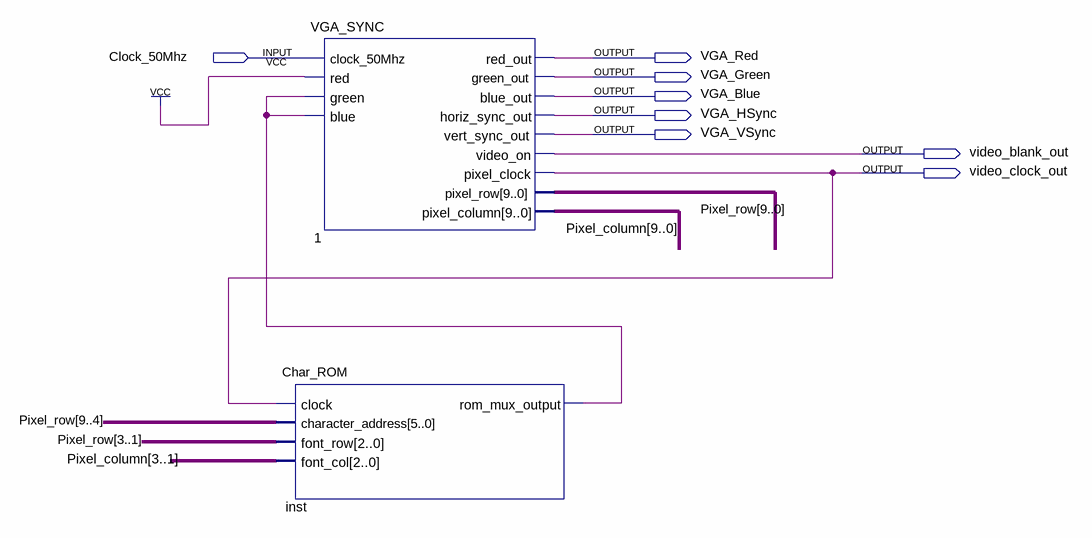
[diagram p0: schematic sheet]
// Quartus schematic VGA_CHARACTER.bdf as structural Verilog: 2 symbols, 8 pins
module VGA_CHARACTER (
  input  Clock_50Mhz,
  output VGA_Red,
  output VGA_Green,
  output VGA_Blue,
  output VGA_HSync,
  output VGA_VSync,
  output video_blank_out,
  output video_clock_out
);

  wire inst_rom_mux_output;
  wire [9:0] Pixel_column, Pixel_row;

  VGA_SYNC u_1 (
    .red(1'b1), .green(inst_rom_mux_output), .blue(inst_rom_mux_output), .clock_50Mhz(Clock_50Mhz),
    .red_out(VGA_Red), .green_out(VGA_Green), .blue_out(VGA_Blue), .horiz_sync_out(VGA_HSync),
    .vert_sync_out(VGA_VSync), .video_on(video_blank_out), .pixel_clock(video_clock_out),
    .pixel_row(Pixel_row), .pixel_column(Pixel_column));
  Char_ROM inst (
    .clock(video_clock_out), .character_address(Pixel_row[9:4]), .font_row(Pixel_row[3:1]),
    .font_col(Pixel_column[3:1]), .rom_mux_output(inst_rom_mux_output));
endmodule
